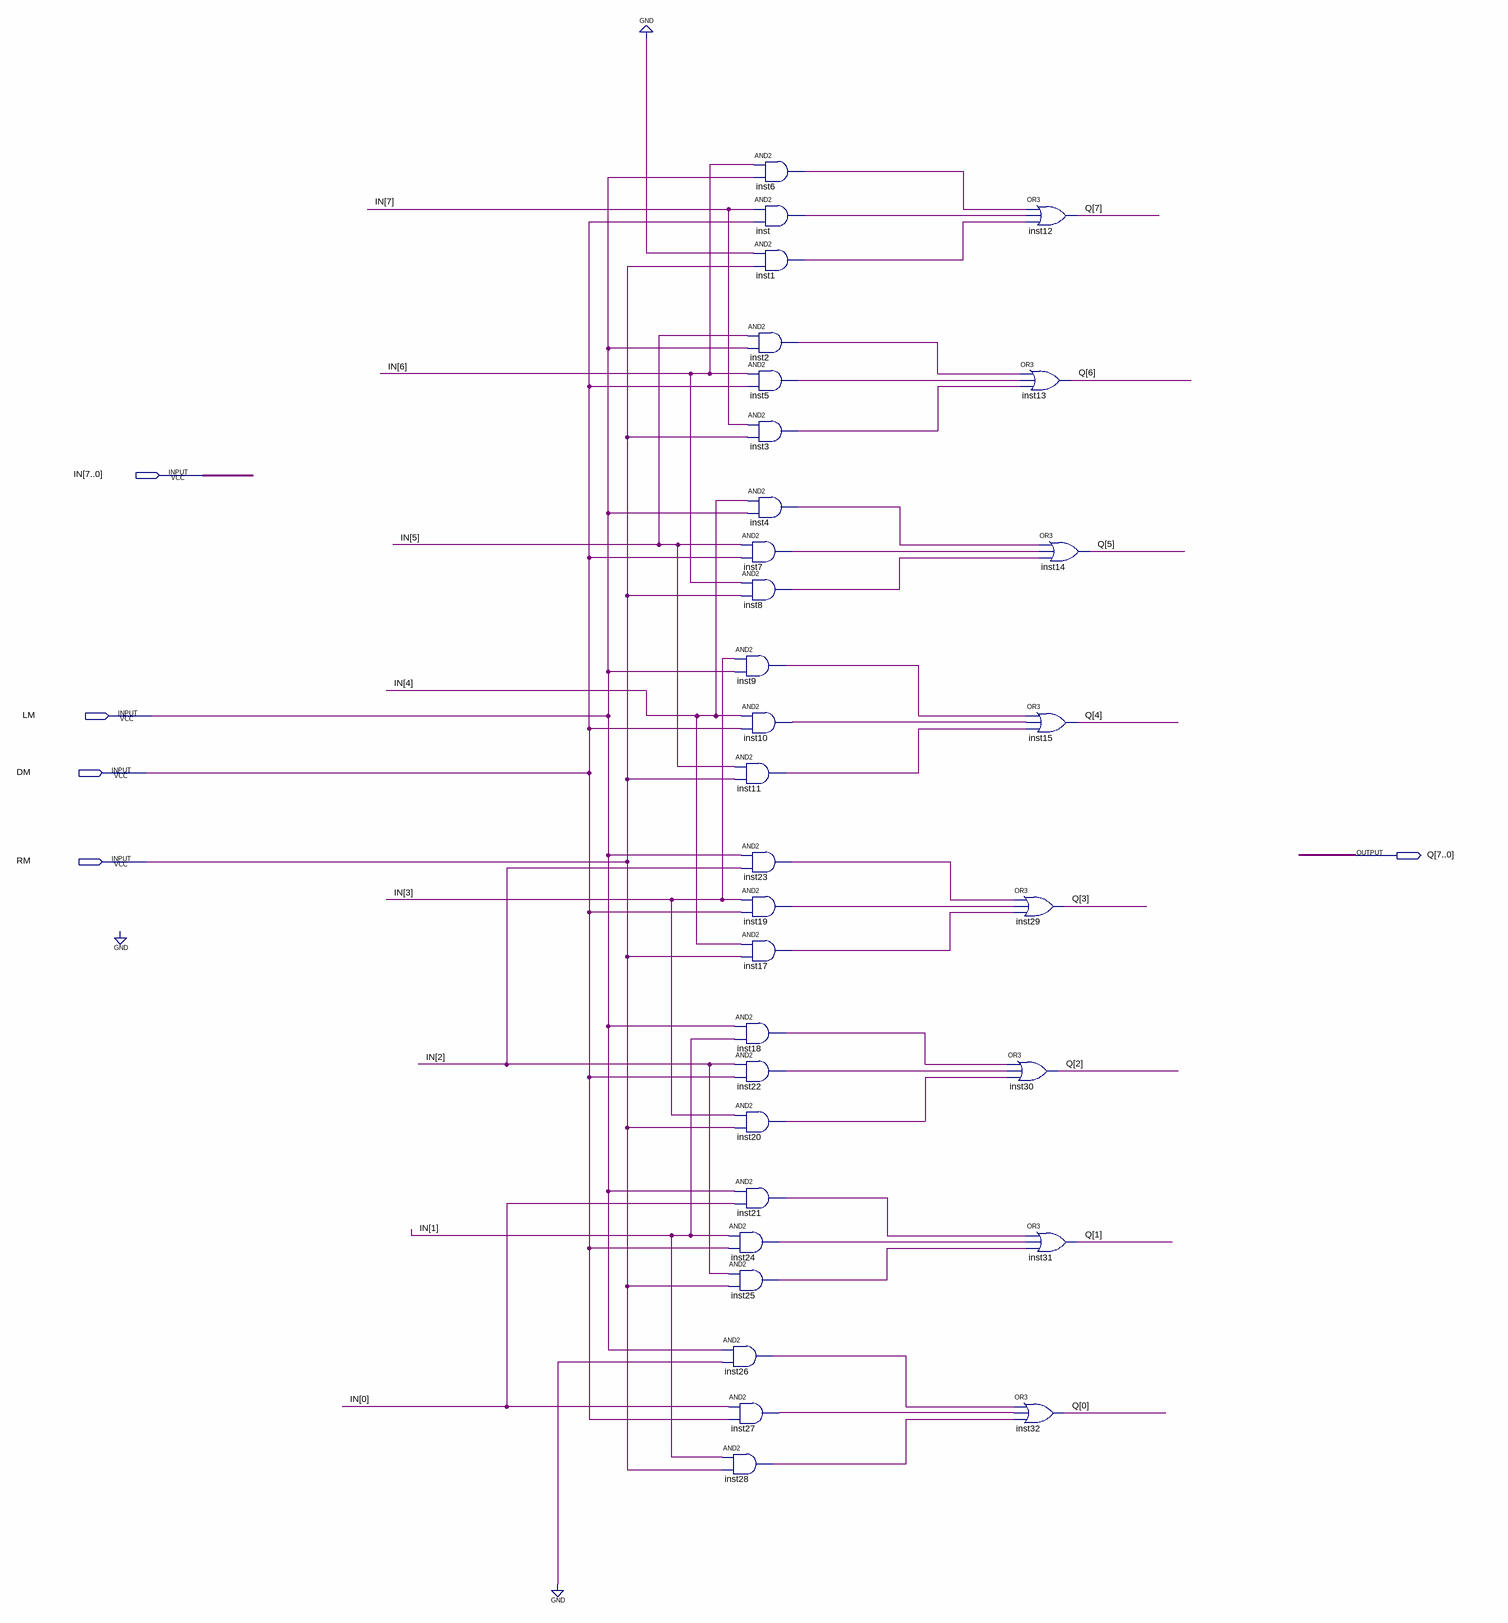
[diagram p0: schematic sheet]
// Quartus schematic shift.bdf as structural Verilog: 32 symbols, 5 pins
module shift (
  input  [7:0] IN,
  input  LM,
  input  DM,
  input  RM,
  output [7:0] Q
);

  wire inst1_out, inst2_out, inst3_out, inst4_out, inst5_out, inst6_out, inst7_out, inst8_out, inst9_out,
       inst10_out, inst11_out, inst17_out, inst18_out, inst19_out, inst20_out, inst21_out, inst22_out,
       inst23_out, inst24_out, inst25_out, inst26_out, inst27_out, inst28_out, inst_out;

  and inst7 (inst7_out, IN[5], DM);
  and inst8 (inst8_out, IN[6], RM);
  and inst9 (inst9_out, IN[3], LM);
  and inst10 (inst10_out, IN[4], DM);
  and inst11 (inst11_out, IN[5], RM);
  and inst23 (inst23_out, LM, IN[2]);
  and inst19 (inst19_out, IN[3], DM);
  and inst17 (inst17_out, IN[4], RM);
  and inst18 (inst18_out, LM, IN[1]);
  and inst22 (inst22_out, IN[2], DM);
  and inst20 (inst20_out, IN[3], RM);
  and inst21 (inst21_out, LM, IN[0]);
  and inst24 (inst24_out, IN[1], DM);
  and inst25 (inst25_out, IN[2], RM);
  and inst26 (inst26_out, LM, 1'b0);
  and inst27 (inst27_out, IN[0], DM);
  and inst28 (inst28_out, IN[1], RM);
  and inst6 (inst6_out, IN[6], LM);
  and inst (inst_out, IN[7], DM);
  and inst1 (inst1_out, 1'b0, RM);
  and inst2 (inst2_out, IN[5], LM);
  and inst5 (inst5_out, IN[6], DM);
  and inst3 (inst3_out, IN[7], RM);
  and inst4 (inst4_out, IN[4], LM);
  or inst12 (Q[7], inst6_out, inst_out, inst1_out);
  or inst13 (Q[6], inst2_out, inst5_out, inst3_out);
  or inst14 (Q[5], inst4_out, inst7_out, inst8_out);
  or inst15 (Q[4], inst9_out, inst10_out, inst11_out);
  or inst29 (Q[3], inst23_out, inst19_out, inst17_out);
  or inst30 (Q[2], inst18_out, inst22_out, inst20_out);
  or inst31 (Q[1], inst21_out, inst24_out, inst25_out);
  or inst32 (Q[0], inst26_out, inst27_out, inst28_out);
endmodule
